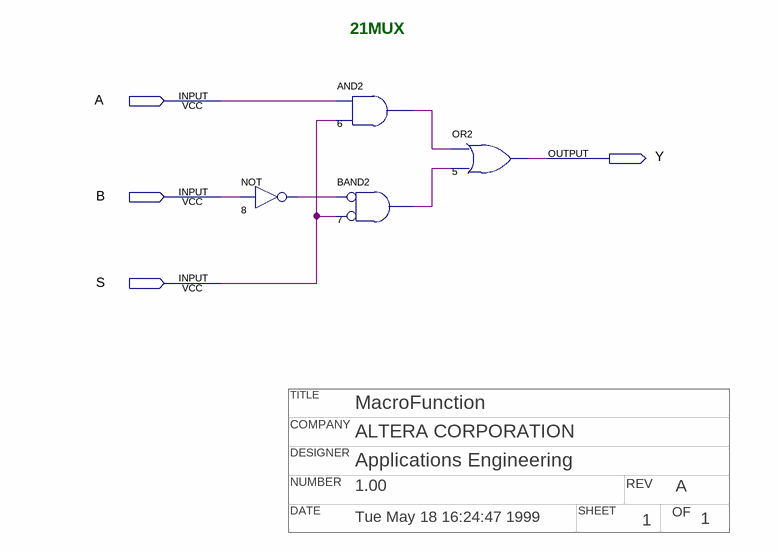
[diagram p0: schematic sheet]
// Quartus schematic 21mux.bdf as structural Verilog: 4 symbols, 4 pins
// Title block: TITLE: MacroFunction; COMPANY: ALTERA CORPORATION; DESIGNER: Applications Engineering; NUMBER: 1.00; REV: A; DATE: Tue May 18 16:24:47 1999; SHEET: 1; OF: 1
module \21mux  (
  input  A,
  input  B,
  input  S,
  output Y
);

  wire n6_out, n7_out, n8_out;

  not u_8 (n8_out, B);
  and u_6 (n6_out, A, S);
  and u_7 (n7_out, ~n8_out, ~S);  // BAND2
  or u_5 (Y, n6_out, n7_out);

  // Notes on the sheet:
  //   21MUX
endmodule
